# Altium project EmbebidosParte2.PrjPcb
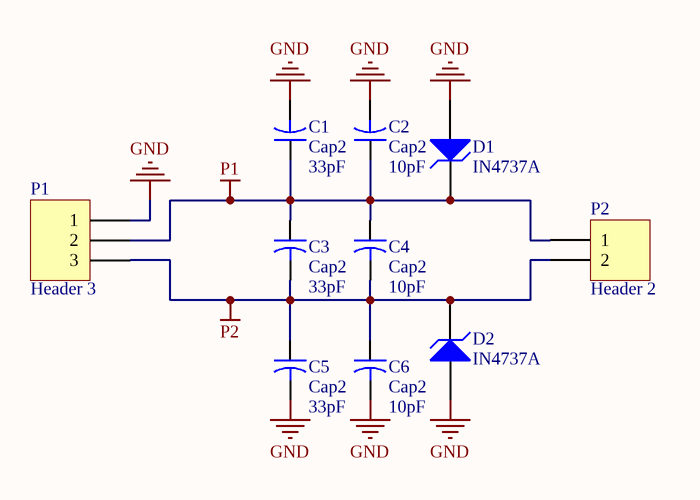
[diagram p0: TarjetaMicrofono.SchDoc]
2 sheets, 40 parts. Net scope: global (net labels, ports and power ports of the same name join across sheets).
Board files: TarjetaMicrofono.PcbDoc, TarjetaModulo.PcbDoc
Sheets:
  TarjetaMicrofono.SchDoc
  TarjetaModulo.SchDoc

## Sheet TarjetaMicrofono.SchDoc
size A4

### Parts
C1  Cap2  value 33pF  [CAPR5-4X5]
C2  Cap2  value 10pF  [CAPR5-4X5]
C3  Cap2  value 33pF  [CAPR5-4X5]
C4  Cap2  value 10pF  [CAPR5-4X5]
C5  Cap2  value 33pF  [CAPR5-4X5]
C6  Cap2  value 10pF  [CAPR5-4X5]
D1  IN4737A  [DIODE-0.7]
D2  IN4737A  [DIODE-0.7]
P1  Header 3  [HDR1X3]
P2  Header 2  [HDR1X2]

### Nets
GND: C1.2 C2.2 C5.2 C6.2 D1.1(A) D2.1(A) P1.1
P1: C1.1 C2.1 C3.1 C4.1 D1.2(K) P1.2 P2.1
P2: C3.2 C4.2 C5.1 C6.1 D2.2(K) P1.3 P2.2

### Library data of the parts
C1-C6 = Cap2: Capacitor; Published: 23-Sep-2002; PackageReference: CAPR5-4X5; Publisher: Altium Limited; PackageDescription: Capacitor; 2 Leads
D1 D2 = D Zener: Zener Diode; Published: 8-Jun-2000; LatestRevisionDate: 17-Jul-2002; LatestRevisionNote: Re-released for DXP Platform.; PackageReference: DIODE-0.7; Publisher: Altium Limited; PackageDescription: Diode, Thru-Hole; 2 Leads; 0.7 in Pin Spacing
P1 = Header 3: Header, 3-Pin; LatestRevisionDate: 17-Jul-2002; LatestRevisionNote: Re-released for DXP Platform.; Publisher: Altium Limited
P2 = Header 2: Header, 2-Pin; LatestRevisionDate: 17-Jul-2002; LatestRevisionNote: Re-released for DXP Platform.; Publisher: Altium Limited

## Sheet TarjetaModulo.SchDoc
size A4
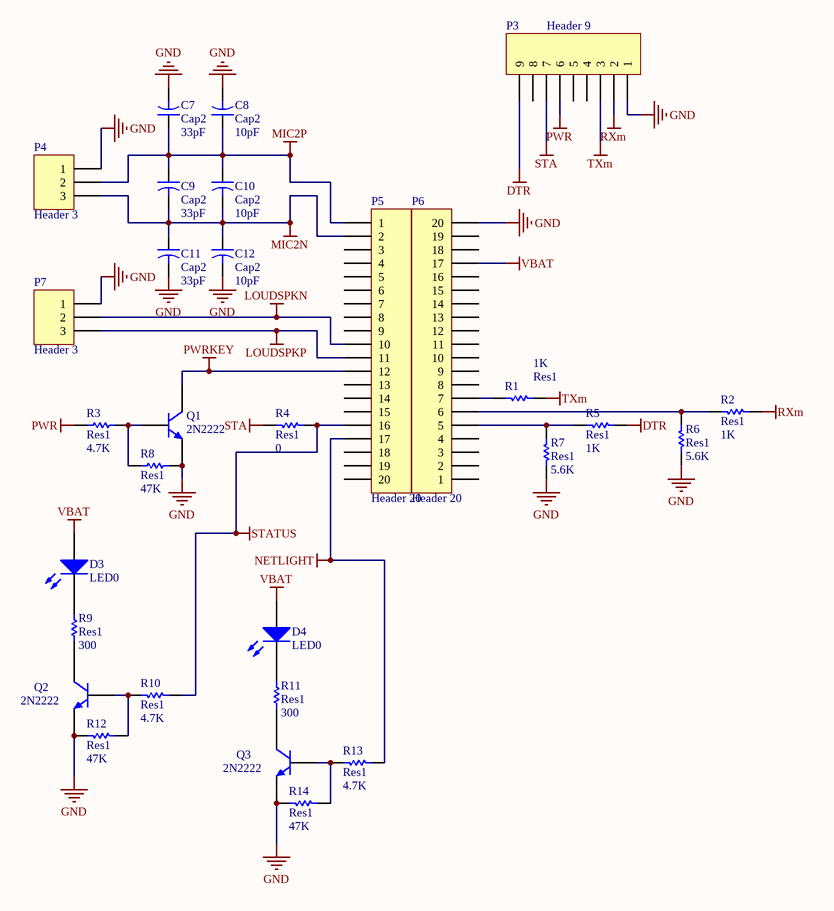
[diagram p1: TarjetaModulo.SchDoc]

### Parts
C7  Cap2  value 33pF  [CAPR5-4X5]
C8  Cap2  value 10pF  [CAPR5-4X5]
C9  Cap2  value 33pF  [CAPR5-4X5]
C10  Cap2  value 10pF  [CAPR5-4X5]
C11  Cap2  value 33pF  [CAPR5-4X5]
C12  Cap2  value 10pF  [CAPR5-4X5]
D3  LED0  [LED-0]
D4  LED0  [LED-0]
P3  Header 9  [HDR1X9]
P4  Header 3  [HDR1X3]
P5  Header 20  [HDR1X20]
P6  Header 20  [HDR1X20]
P7  Header 3  [HDR1X3]
Q1  2N2222  [TO-92A]
Q2  2N2222  [TO-92A]
Q3  2N2222  [TO-92A]
R1  Res1  value 1K  [AXIAL-0.3]
R2  Res1  value 1K  [AXIAL-0.3]
R3  Res1  value 4.7K  [AXIAL-0.3]
R4  Res1  value 0  [AXIAL-0.3]
R5  Res1  value 1K  [AXIAL-0.3]
R6  Res1  value 5.6K  [AXIAL-0.3]
R7  Res1  value 5.6K  [AXIAL-0.3]
R8  Res1  value 47K  [AXIAL-0.3]
R9  Res1  value 300  [AXIAL-0.3]
R10  Res1  value 4.7K  [AXIAL-0.3]
R11  Res1  value 300  [AXIAL-0.3]
R12  Res1  value 47K  [AXIAL-0.3]
R13  Res1  value 4.7K  [AXIAL-0.3]
R14  Res1  value 47K  [AXIAL-0.3]

### Nets
DTR: P3.9 R5.1
GND: C7.2 C8.2 C11.2 C12.2 P3.1 P4.1 P6.20 P7.1 Q1.1(E) Q2.1(E) Q3.1(E) R6.2 R7.2 R8.2 R12.2 R14.2
LOUDSPKN: P5.10 P7.2
LOUDSPKP: P5.11 P7.3
MIC2N: C9.2 C10.2 C11.1 C12.1 P4.3 P5.2
MIC2P: C7.1 C8.1 C9.1 C10.1 P4.2 P5.1
NETLIGHT: P5.17 R13.1
PWR: P3.6 R3.1
PWRKEY: P5.12 Q1.3(C)
RXm: P3.2 R2.1
STA: P3.7 R4.2
STATUS: P5.16 R4.1 R10.1
TXm: P3.3 R1.1
VBAT: D3.1(A) D4.1(A) P6.17
NetD3_2: D3.2(K) R9.2
NetD4_2: D4.2(K) R11.2
NetP6_5: P6.5 R5.2 R7.1
NetP6_6: P6.6 R2.2 R6.1
NetP6_7: P6.7 R1.2
NetQ1_2: Q1.2(B) R3.2 R8.1
NetQ2_2: Q2.2(B) R10.2 R12.1
NetQ2_3: Q2.3(C) R9.1
NetQ3_2: Q3.2(B) R13.2 R14.1
NetQ3_3: Q3.3(C) R11.1

Not connected (* = marked no-connect by the designer): P3 4 5 8; P5 3 4 5 6 7 8 9 13 14 15 18 19 20; P6 1 2 3 4 8 9 10 11 12 13 14 15 16 18 19

### Library data of the parts
C7-C12 = Cap2: Capacitor; Published: 23-Sep-2002; PackageReference: CAPR5-4X5; Publisher: Altium Limited; PackageDescription: Capacitor; 2 Leads
D3 D4 = LED0: Typical INFRARED GaAs LED; Published: 8-Jun-2000; LatestRevisionDate: 08-Jul-2005; LatestRevisionNote: Mech Layer 1 removed.; PackageReference: LED-0; Publisher: Altium Limited; PackageDescription: LED; 2 Leads
P3 = Header 9: Header, 9-Pin; LatestRevisionDate: 17-Jul-2002; LatestRevisionNote: Re-released for DXP Platform.; Publisher: Altium Limited
P4 P7 = Header 3: Header, 3-Pin; LatestRevisionDate: 17-Jul-2002; LatestRevisionNote: Re-released for DXP Platform.; Publisher: Altium Limited
P5 P6 = Header 20: Header, 20-Pin; LatestRevisionDate: 17-Jul-2002; LatestRevisionNote: Re-released for DXP Platform.; Publisher: Altium Limited
Q1-Q3 = 2N3904: NPN General Purpose Amplifier; Published: 8-Jun-2000; LatestRevisionDate: 15-Jan-2003; LatestRevisionNote: PCB Footprint 'BCY-W3/D4.7' replaced; DatasheetVersion: 1997; PackageVersion: Sep-1998; PackageReference: TO-92A; Publisher: Altium Limited; PackageDescription: TO, Flat Index; 3 In-Line, Axial Leads; Body Dia. 4.5mm; Leads 0.51 x 0.48 mm (max); ComponentLink1Description: Manufacturer Link; ComponentLink1URL: http://www.fairchildsemi.com/; ComponentLink2Description: Datasheet; ComponentLink2URL: http://www.fairchildsemi.com/ds/2N%2F2N3904.pdf
R1-R14 = Res1: Resistor; Published: 8-Jun-2000; LatestRevisionDate: 17-Jul-2002; LatestRevisionNote: Re-released for DXP Platform.; PackageReference: AXIAL-0.3; Publisher: Altium Limited; PackageDescription: Axial Device, Thru-Hole; 2 Leads; 0.3 in Pin Spacing

## Nets that join several sheets
GND: TarjetaMicrofono (7 pins), TarjetaModulo (16 pins)